# EAGLE design SHASwitch4 (EAGLE 6.5.0)
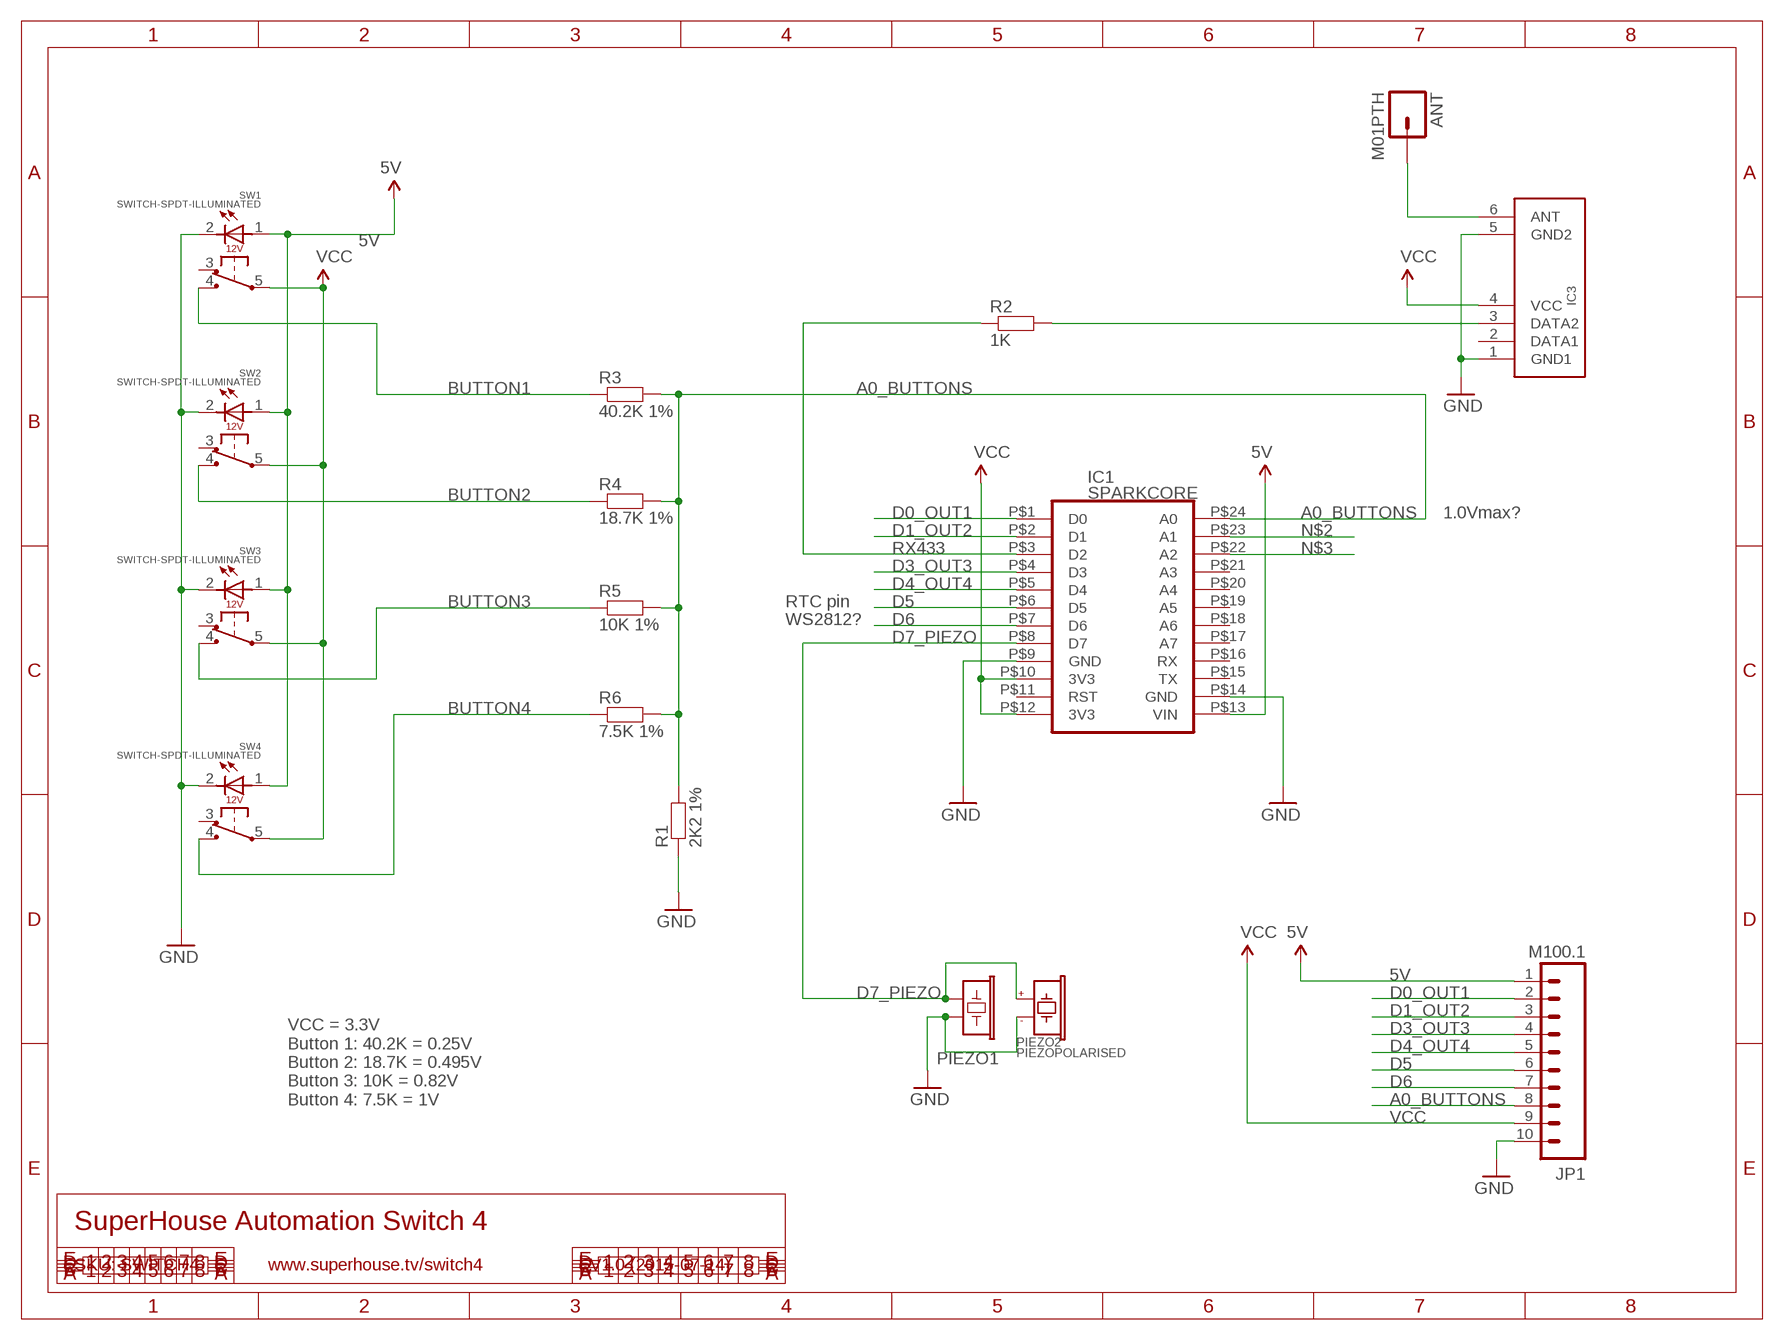
[diagram p0: schematic, sheet 1]

## Parts
ANT  M01PTH  [1X01]
IC1  SPARKCORE  [SPARKCORE]
IC3  RXB1  RXB1SHORTFLAT  [RX-B1-SHORT-FLAT]
JP1  M100.1  [1X10]
PIEZO1  BUZZERSMD12X12  [BUZZER-12X12-SMT]
PIEZO2  PIEZOPOLARISED  [PIEZO12MMWIDEPOLARISED]
R1  2K2 1%  RESISTOR0603  [0603]
R2  1K  RESISTOR0603  [0603]
R3  40.2K 1%  RESISTOR0603  [0603]
R4  18.7K 1%  RESISTOR0603  [0603]
R5  10K 1%  RESISTOR0603  [0603]
R6  7.5K 1%  RESISTOR0603  [0603]
SW1  SWITCH-SPDT-ILLUMINATED  [SWITCH-SPDT-ILLUMINATED]
SW2  SWITCH-SPDT-ILLUMINATED  [SWITCH-SPDT-ILLUMINATED]
SW3  SWITCH-SPDT-ILLUMINATED  [SWITCH-SPDT-ILLUMINATED]
SW4  SWITCH-SPDT-ILLUMINATED  [SWITCH-SPDT-ILLUMINATED]

## Nets
5V: IC1.P$13(VIN) JP1.1 SW1.1(+) SW2.1(+) SW3.1(+) SW4.1(+)
A0_BUTTONS: IC1.P$24(A0) JP1.8 R1.2 R3.2 R4.2 R5.2 R6.2
BUTTON1: R3.1 SW1.4(NO)
BUTTON2: R4.1 SW2.4(NO)
BUTTON3: R5.1 SW3.4(NO)
BUTTON4: R6.1 SW4.4(NO)
D0_OUT1: IC1.P$1(D0) JP1.2
D1_OUT2: IC1.P$2(D1) JP1.3
D3_OUT3: IC1.P$4(D3) JP1.4
D4_OUT4: IC1.P$5(D4) JP1.5
D5: IC1.P$6(D5) JP1.6
D6: IC1.P$7(D6) JP1.7
D7_PIEZO: IC1.P$8(D7) PIEZO1.1 PIEZO2.1(+)
GND: IC1.P$9(GND) IC1.P$14(GND) IC3.1(GND1) IC3.5(GND2) JP1.10 PIEZO1.2 PIEZO2.2(-) R1.1 SW1.2(-) SW2.2(-) SW3.2(-) SW4.2(-)
N$1: ANT.1 IC3.6(ANT)
N$2: IC1.P$23(A1)
N$3: IC1.P$22(A2)
N$135: IC3.3(DATA2) R2.2
RX433: IC1.P$3(D2) R2.1
VCC [VCC]: IC1.P$10(3V3) IC1.P$12(3V3) IC3.4(VCC) JP1.9 SW1.5(COM) SW2.5(COM) SW3.5(COM) SW4.5(COM)
Unconnected: IC1.P$11(RST) IC1.P$15(TX) IC1.P$16(RX) IC1.P$17(A7) IC1.P$18(A6) IC1.P$19(A5) IC1.P$20(A4) IC1.P$21(A3) IC3.2(DATA1) SW1.3(NC) SW2.3(NC) SW3.3(NC) SW4.3(NC)

## Notes on the sheet
- 1.0Vmax?
- RTC pin
- WS2812?
- VCC = 3.3V
  Button 1: 40.2K = 0.25V
  Button 2: 18.7K = 0.495V
  Button 3: 10K = 0.82V
  Button 4: 7.5K = 1V
- SuperHouse Automation Switch 4
- SKU: SWITCH4 | www.superhouse.tv/switch4 | V1.0 (2015-07-14)

## Library data of the parts
ANT = freetronics:M01: Header 1 Standard 1-pin 0.1" header. Use with straight break away headers (SKU : PRT-00116), right angle break away headers (PRT-00553), swiss pins (PRT-00743), machine pins (PRT-00117), and female headers (PRT-00115).
IC1 = freetronics-jon:SPARKCORE
IC3 = freetronics-master-v1:RXB1SHORT
JP1 = freetronics-original:M10: Header 10 Standard 10-pin 0.1" header. Use with straight break away headers (SKU : PRT-00116), right angle break away headers (PRT-00553), swiss pins (PRT-00743), machine pins (PRT-00117), and female headers (PRT-00115).
PIEZO1 = freetronics-master-v1:BUZZER: Buzzer - Piezo Transducer
PIEZO2 = freetronics-jon:PIEZOPOLARISED
R1-R6 = freetronics:RESISTOR: Resistor Basic schematic elements and footprints for 0603, 1206, and PTH 1/10th watt (small) resistors.
SW1-SW4 = freetronics-jon:SWITCH-SPDT-ILLUMINATED

## Net classes
0 Default: width 0.203 mm
1 VCC: width 0.305 mm

## Board
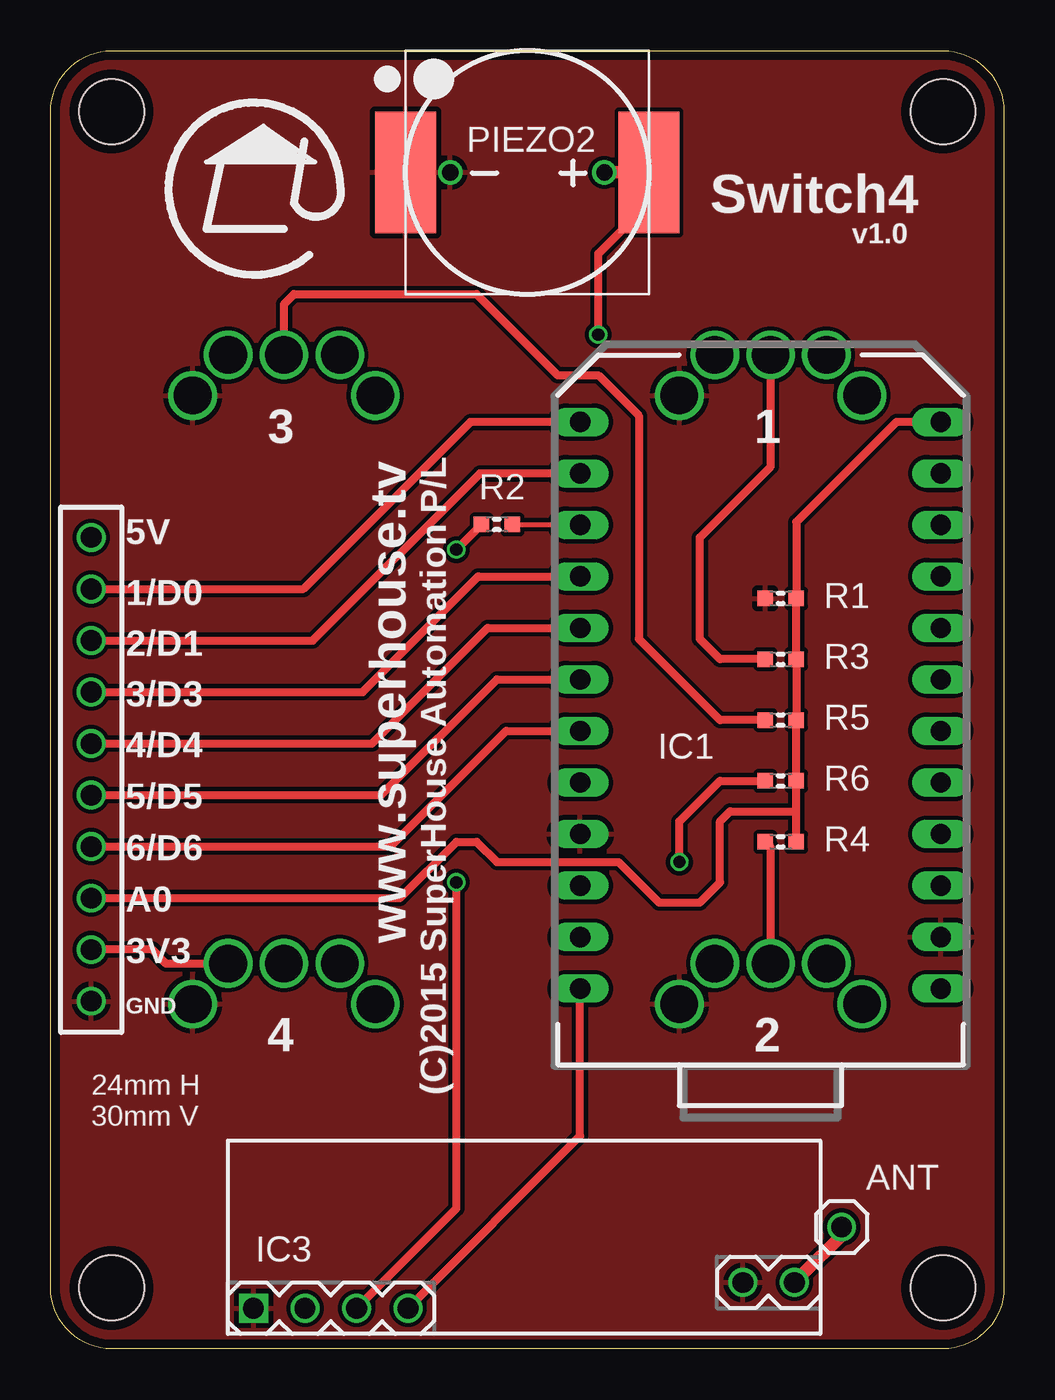
[diagram p1: board, top side]
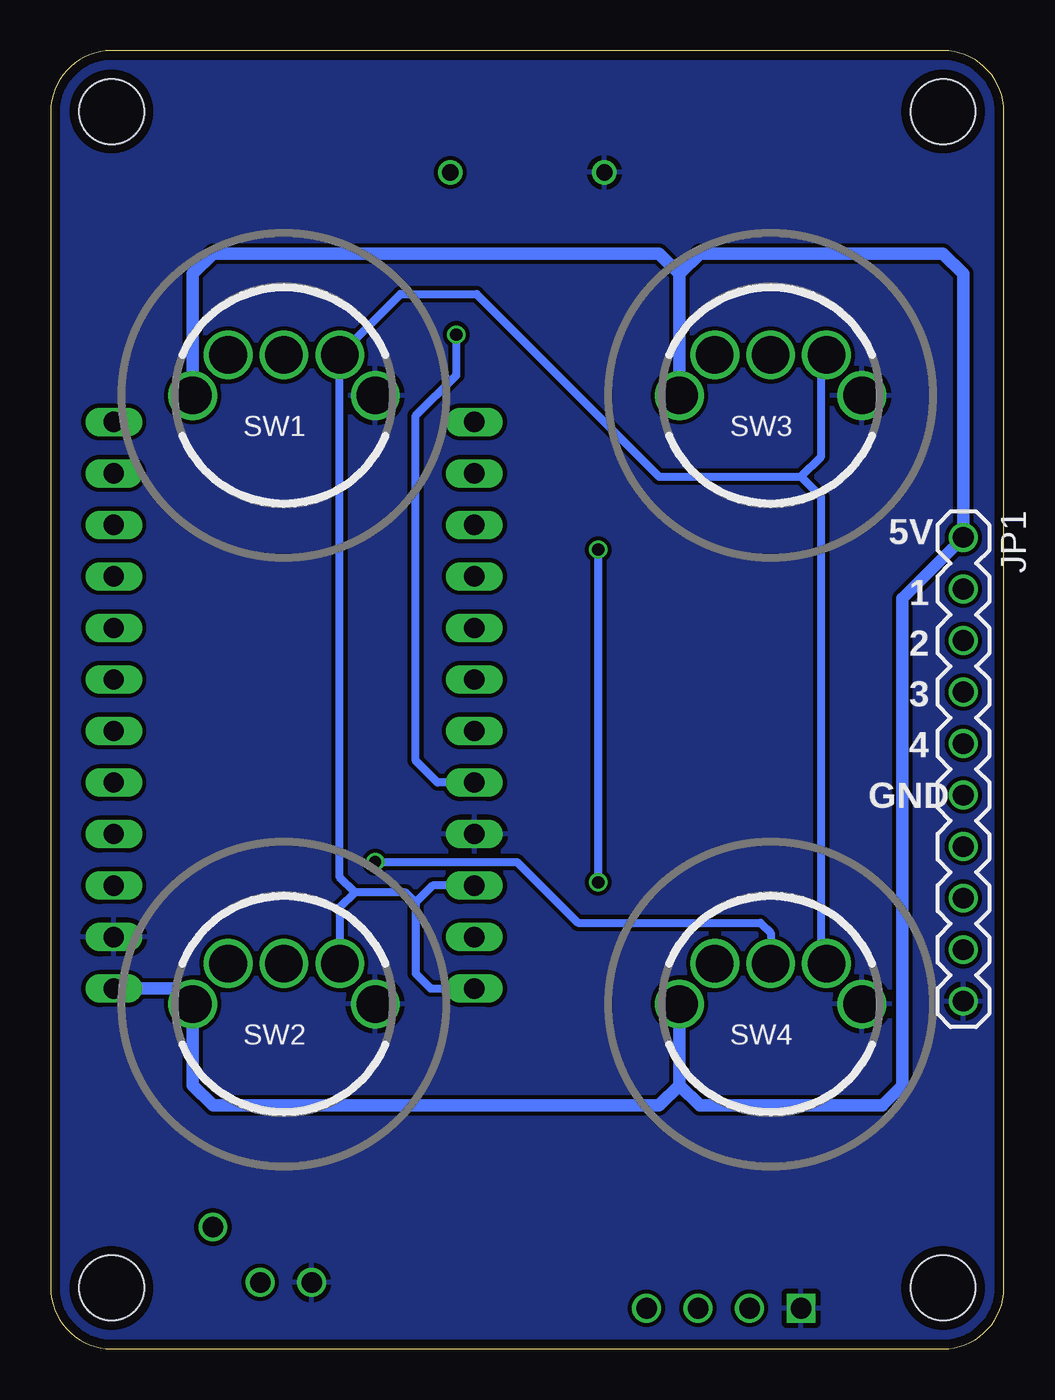
[diagram p2: board, bottom side, seen from below]

Size 47 x 64 mm. Coordinates in mm from the lower left corner, seen from the top.
Outline: 3,64 44,64 arc-90 47,61 47,3 arc-90 44,0 3,0 arc-90 0,3 0,61 arc-90 3,64
Copper layers (1*16): Top 0.035mm / dielectric 1.5mm / Bottom 0.035mm
Design rules "default *": minimum track width 8mil, minimum drill 15mil, track to track 8mil, track to pad 8mil, pad to pad 8mil, via to via 8mil, smd to smd 8mil, copper to edge 18mil, drill to drill 8mil, minimum pad ring 8mil, minimum via ring 6mil, stop-mask expansion 4mil, vias tented up to drill 25mil, thermal gap 10mil
Holes 3.2 mm at 44,3 3,3 3,61 44,61

### Footprints (pad centres in the part's own frame; a part is rotated, then mirrored left to right if it is on the bottom)
1X01 = drill 1.016: 1 0,0
SPARKCORE = drill 1 long: P$1 -8.89,12.7; P$2 -8.89,10.16; P$3 -8.89,7.62; P$4 -8.89,5.08; P$5 -8.89,2.54; P$6 -8.89,0; P$7 -8.89,-2.54; P$8 -8.89,-5.08; P$9 -8.89,-7.62; P$10 -8.89,-10.16; P$11 -8.89,-12.7; P$12 -8.89,-15.24; P$13 8.89,-15.24; P$14 8.89,-12.7; P$15 8.89,-10.16; P$16 8.89,-7.62; P$17 8.89,-5.08; P$18 8.89,-2.54; P$19 8.89,0; P$20 8.89,2.54; P$21 8.89,5.08; P$22 8.89,7.62; P$23 8.89,10.16; P$24 8.89,12.7
RX-B1-SHORT-FLAT = drill 1.016 square: 1 0,0 | drill 1.016: 2 2.54,0; 3 5.08,0; 4 7.62,0; 5 24.13,1.27; 6 26.67,1.27
1X10 = drill 1.016: 1 0,0; 2 2.54,0; 3 5.08,0; 4 7.62,0; 5 10.16,0; 6 12.7,0; 7 15.24,0; 8 17.78,0; 9 20.32,0; 10 22.86,0
BUZZER-12X12-SMT = smd 3 x 6: 1 -6,0; 2 6,0
PIEZO12MMWIDEPOLARISED = drill 0.8: 1 -3.8,0; 2 3.8,0
0603 = smd 0.762 x 0.762: 1 -0.762,0; 2 0.762,0
SWITCH-SPDT-ILLUMINATED = drill 1.85 pad 2.4: 1 -4.5,0; 2 4.5,0; 3 -2.75,2; 4 0,2; 5 2.75,2

### Placement (x,y rotation side)
ANT  39,6 0 top
IC1  35,33 0 top
IC3  10,2 0 top
JP1  2,40 270 bottom
PIEZO1  23.5,58 180 top
PIEZO2  23.5,58 180 top
R1  36,37 0 top
R2  22,40.64 180 top
R3  36,34 0 top
R4  36,25 0 top
R5  36,31 0 top
R6  36,28 0 top
SW1  35.5,47 0 bottom
SW2  35.5,17 0 bottom
SW3  11.5,47 0 bottom
SW4  11.5,17 0 bottom

### Tracks (layer width: path | path; a pad name or v marks a point on that pad's centre or on a via)
5V
  Bottom 0.61: 16,13 15,12 6,12 5,13 5,37 JP1.1 2,53 3,54 15,54 16,53 | 16,13 17,12 39,12 40,13 SW2.1 40.76,17.76 IC1.P$13 | SW4.1 16,13 | 16,53 SW3.1 | 16,53 17,54 39,54 40,53 SW1.1
A0_BUTTONS
  Top 0.406: IC1.P$24 41.7,45.7 36.76,40.76 R1.2 R3.2 R5.2 R6.2 36.76,26.5 | R4.2 36.76,26.5 | JP1.8 17.22,22.22 20,25 21,25 22,24 28,24 30,22 32,22 33,23 33,26 33.5,26.5 36.76,26.5
BUTTON1
  Top 0.406: SW1.4 35.5,43.5 32,40 32,35 33,34 R3.1
BUTTON2
  Top 0.406: SW2.4 35.5,24.74 R4.1
BUTTON3
  Top 0.406: SW3.4 11.5,51.5 12,52 21,52 25,48 27,48 29,46 29,35 33,31 R5.1
BUTTON4  (via drill 0.6)
  Top 0.406: v31,24 31,26 33,28 R6.1
  Bottom 0.406: v31,24 24,24 21,21 12,21 11.5,20.5 SW4.4
D0_OUT1
  Top 0.406: IC1.P$1 20.7,45.7 12.46,37.46 JP1.2
D1_OUT2
  Top 0.406: IC1.P$2 21.16,43.16 12.92,34.92 JP1.3
D3_OUT3
  Top 0.406: JP1.4 15.38,32.38 21.08,38.08 IC1.P$4
D4_OUT4
  Top 0.406: JP1.5 15.84,29.84 21.54,35.54 IC1.P$5
D5
  Top 0.406: JP1.6 16.3,27.3 22,33 IC1.P$6
D6
  Top 0.406: JP1.7 16.76,24.76 22.46,30.46 IC1.P$7
D7_PIEZO  (via drill 0.6)
  Top 0.406: v27,50 27,54 30,57 30,58
  Top 0.61: PIEZO2.1 PIEZO1.1 30,58
  Bottom 0.406: IC1.P$8 27.92,27.92 29,29 29,46 27,48 v27,50
GND
  pour Top: 3,0 44,0 arc90 47,3 47,61 arc90 44,64 3,64 arc90 0,61 0,3 arc90
  pour Bottom: 3,0 44,0 arc90 47,3 47,61 arc90 44,64 3,64 arc90 0,61 0,3 arc90
N$1
  Top 0.61: IC3.6 39.4,6 ANT.1
N$135  (via drill 0.6)
  Top 0.406: IC3.3 20,6.92 v20,23 | v20,39.4 R2.2
  Bottom 0.406: v20,23 v20,39.4
RX433
  Top 0.254: R2.1 26.11,40.64 IC1.P$3
VCC
  Top 0.406: IC3.4 26.11,10.49 IC1.P$12 | SW4.5 5.68,19 5,19.68 JP1.9
  Bottom 0.406: SW4.5 9,19.25 9,42 10,43 | 10,43 17,43 26,52 29.75,52 SW1.5 32.75,23.25 32,22.5 | 10,43 9,44 9,48.75 SW3.5 | IC1.P$10 28.16,22.84 29,22 | 29,22 29,18.5 28.26,17.76 IC1.P$12 | 29,22 29.5,22.5 32,22.5 | 32,22.5 32.75,21.75 SW2.5

### Text on the board
tPlace: Switch4 | v1.0 | 3 | 1 | 5V | 1/D0 | 2/D1 | 3/D3 | 4/D4 | 5/D5 | 6/D6 | A0 | www.superhouse.tv | 3V3 | GND | 4 | 2 | (C)2015 SuperHouse Automation P/L | 24mm H / 30mm V
bPlace: 5V | 1 | 2 | 3 | 4 | GND